# Altium schematic sheet GD_AirIrDA_485.SchDoc
size A4
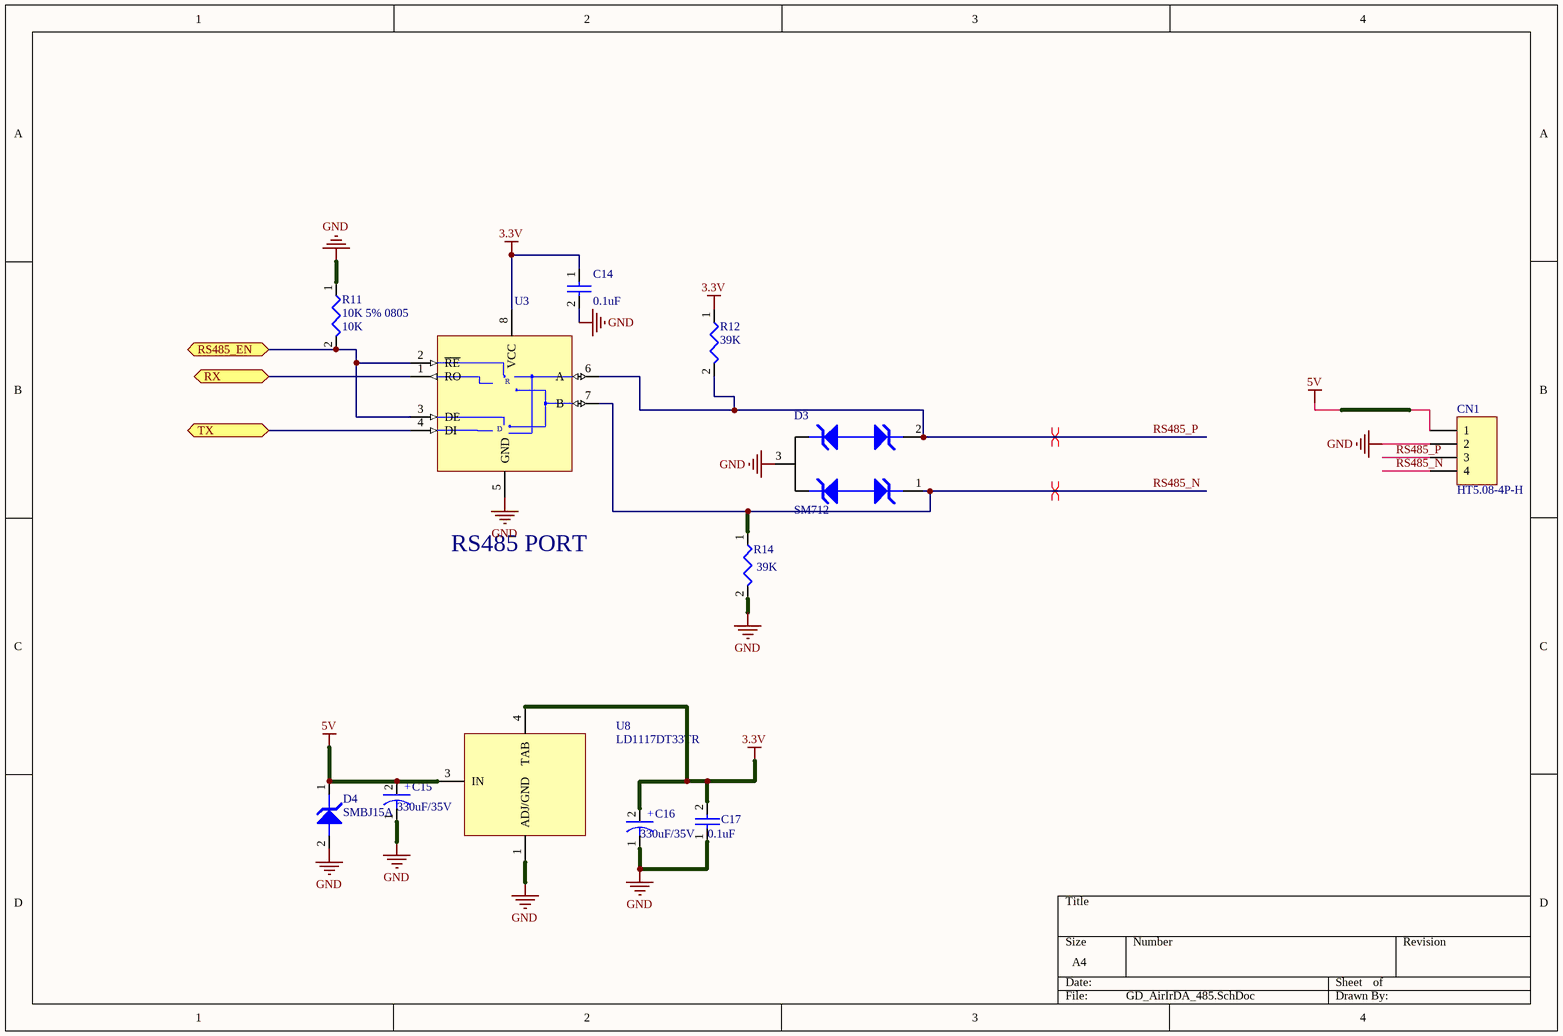
[diagram p0: GD_AirIrDA_485.SchDoc]

## Parts
C14  value 0.1uF  [C0805]  (hidden comment: CAP 0.1uF 20% 50V 0805)
C15  value 330uF/35V  [CA10X16P5]  (hidden comment: CAPACITOR 330uF 20% 35V 10mmX16mm)
C16  value 330uF/35V  [CA10X16P5]  (hidden comment: CAPACITOR 330uF 20% 35V 10mmX16mm)
C17  value 0.1uF  [C0805]  (hidden comment: CAP 0.1uF 20% 50V 0805)
CN1  HT5.08-4P-H  [HT5.08-4P-H]
D3  SM712  [SOT23-123]
D4  SMBJ15A  [SMB]
R11  10K 5% 0805  value 10K  [R0805]
R12  value 39K  [R0805]  (hidden comment: 39K 5% 0805)  (no BOM)
R14  value 39K  [R0805]  (hidden comment: 39K 5% 0805)  (no BOM)
U3  SN65HVD08D  [SOIC8]  (value not drawn)
U8  LD1117DT33TR  [DPAK-134]

## Ports
RS485_EN, RX, TX

## Nets
3.3V: C14.1 C16.2 C17.2 R12.1 U3.8(VCC) U8.4(TAB)
5V: C15.2 CN1.1 D4.1 U8.3(IN)
GND: C14.2 C15.1 C16.1 C17.1 CN1.2 D3.3 D4.2 R11.1 R14.2 U3.5(GND) U8.1(ADJ/GND)
RS485_EN: R11.2 U3.2(~{RE}) U3.3(DE) ; port RS485_EN
RS485_N: CN1.4 D3.1 R14.1 U3.7(B)
RS485_P: CN1.3 D3.2 R12.2 U3.6(A)
RX: U3.1(RO) ; port RX
TX: U3.4(DI) ; port TX

## Layout directives
differential pair: RS485_N, RS485_P

## Notes on the sheet
- RS485 PORT
- (in symbol EC00095) +
- (in symbol EU00041) R; D

## Library data of the parts
C14 C17 = EC00014: CAP SMD CR X7R 50V 10% 0.1uF 0805 ROHS; Manufacturer: YAGEO; Manufacturer P/N: CC0805KRX7R9BB104; ID: 14; HelpURL: *; P/N: EC00014
C15 C16 = EC00095: CAP 35V 20% 330uF 10X16X0.6MM ROHS，7000hours; Manufacturer: NIPPON CHEMI-CON; Manufacturer P/N: EKY350ELL331MJ16S; ID: 95; Type: ****; HelpURL: \\192.168.1.3\Esh\Department\RD\CAD\Component\Capacitor\KY(105).pdf; P/N: EC00095
CN1 = Header 4: Header, 4-Pin; Manufacturer P/N: HT5.08-4 Bend; P/N: EE00005; Manufacturer: *
D3 = ED00007: DIODE TVS 7V 12V 17A 400W SOT-23 SMD ROHS; Manufacturer: BOURNS; ID: 7; Value: CDSOT23-SM712; Type: ****; HelpURL: \\192.168.1.3\Esh\Department\RD\CAD\Component\IO_PROTECTION\BOURNS_CDSOT23-SM712.pdf; P/N: ED00007; Manufacturer P/N: CDSOT23-SM712
D4 = ED00032: Manufacturer: Bourns; P/N: EE00002; Type: ****; Manufacturer P/N: SMBJ15A; Value: SMBJ15A
R11 = ER00213: RES THICK_FILM SMD 10K ohm 5% 1/10W ROHS 0603; Manufacturer: YAGEO; Manufacturer P/N: RC0603JR-1310KL; ID: 213; HelpURL: \\192.168.1.3\Esh\Department\RD\CAD\Component\Resistor\SMD\YAGEO_PYu-RC1206_51_RoHS_L_4.pdf; P/N: ER00213
R12 R14 = ER00021: RES THICK_FILM SMD 39K 5% 1/8W ROHS 0805; Manufacturer: YAGEO; Manufacturer P/N: RC0805JR-0739KL; ID: 21; HelpURL: *; P/N: ER00021
U3 = EU00041: IC 5V,RS-485,10Mbps,16KV,TRANSCEIVERS,SOIC-8,ROHS; Manufacturer: Texas Instruments; ID: 41; HelpURL: \\192.168.1.3\Esh\Department\RD\CAD\Component\RS485\sn65hvd08.pdf; P/N: EU00041; Manufacturer P/N: SN65HVD08D; Value: SN65HVD08D; Type: *****
U8 = EU00066: IC REG VOLT +3.3V LDO 800MA DPAK ROHS; Manufacturer: ST; ID: 66; Value: LD1117-3.3; P/N: EU00066; HelpURL: \\192.168.1.3\Esh\Department\RD\CAD\Component\Power_DC_to_DC\LD1117_ST.pdf; Manufacturer P/N: LD1117DT33TR; Type: *****